# Altium schematic sheet AL5 Signal Isolation.SchDoc: AL5 Signal Isolator
size 292 x 193 mm; SheetNumber: 11; SheetTotal: 16
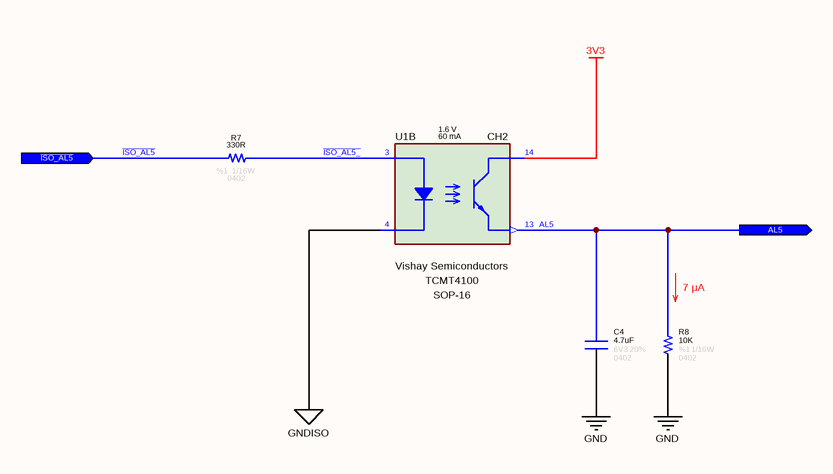
[diagram p0: AL5 Signal Isolation.SchDoc]

## Parts
C4  value 4.7uF  Tolerance: 20%  Case: 0402  Voltage: 6V3  [CAPACITOR_0402]  (hidden comment: Capacitor - 4.7uF [0402] (Ceramic))
R7  value 330R  Case: 0402  Tolerance: %1  Power: 1/16W  [RESISTOR_0402]  (hidden comment: 330R - 0402 - %1 - 1/16W)
R8  value 10K  Tolerance: %1  Case: 0402  Power: 1/16W  [RESISTOR_0402]  (hidden comment: 10K - 0402 - %1 - 1/16W)
U1  If - Forward Current: 60 mA  Vf - Forward Voltage: 1.6 V  Manufacturer Name: Vishay Semiconductors  Case: SOP-16  [SO-16]  (hidden comment: TCMT4100)  (part B of 4)

## Ports
AL5 (out), ~{ISO_AL5} (in)

## Nets
3V3: U1.14(Collector_CH2)
GND: C4.1 R8.1
GNDISO: U1.4(Cathode_CH2)
AL5: C4.2 R8.2 U1.13(Emiter_CH2) ; port AL5
~{ISO_AL5}: R7.2 ; port ~{ISO_AL5}
~{ISO_AL5_}: R7.1 U1.3(Anode_CH2)

## Notes on the sheet
- (near R8) 7 μA
- © 2021 All rights reserved.
  This document may not, in whole or in part, be copied, photocopied, reproduced, translated or converted to any electronic or machine readable from without prior written permission of Mehmet Günce Akkoyun.
  Engineer contact : akkoyun@me.com
- Property of
- Engineer :
- Date :
- Size :
- A4
- Time :
- Project :
- Page :
- /
- Customer :
- Product ID :
- Module ID :
- Version :
- File :
- Revision :
- (in symbol IC - TCMT4100, part B) CH2

## Library data of the parts
C4 = Capacitor - 4.7uF [0402-6V3]: Multilayer Ceramic Capacitors - SMD - 6V3 4.7uF X5R 0402 20%; Manufacturer Part Number: C0402C475M9PACTU; Manufacturer Name: KEMET
R7 = Resistor - 330R [0402]: Thick Film Resistors - SMD 1/16 W 330 Ohm 1%; Manufacturer Name: Vishay; Manufacturer Part Number: CRCW0402330RFKED; ComponentLink1Description: DataSheet; ComponentLink1URL: https://www.mouser.com.tr/datasheet/2/427/dcrcwe3-1762152.pdf; ComponentLink2Description: Mouser; ComponentLink2URL: https://www.mouser.com.tr/ProductDetail/Vishay-Dale/CRCW0402330RFKED?qs=sGAEpiMZZMu61qfTUdNhG2DpbjADlD3GGS6SwBlLi5Q%3D
R8 = Resistor - 10K [0402]: Thick Film Resistors - SMD 1/16 W 10 KOhm 1%; Manufacturer Name: Vishay; Manufacturer Part Number: CRCW040210K0FKED; ComponentLink1Description: DataSheet; ComponentLink1URL: https://www.mouser.com.tr/datasheet/2/427/dcrcwe3-1762152.pdf; ComponentLink2Description: Mouser; ComponentLink2URL: https://www.mouser.com.tr/ProductDetail/Vishay-Dale/CRCW040210K0FKED?qs=sGAEpiMZZMu61qfTUdNhG2DpbjADlD3GcalbOv9utCY%3D
U1 = IC - TCMT4100: OptpCoupler 4CH 16 Pin (SOP16); Number of Channels: 4 Channel; Maximum Collector Emitter Saturation Voltage: 0.3 V; Manufacturer Part Number: TCMT4100